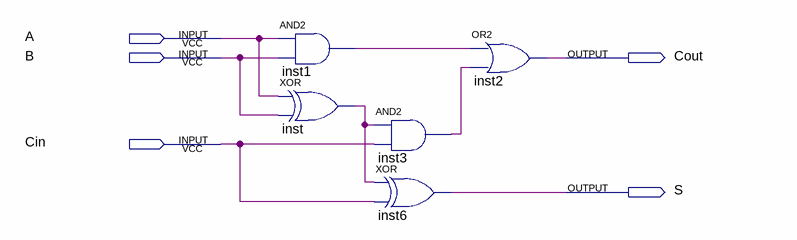
[diagram p0: schematic sheet]
// Quartus schematic sum_1b.bdf as structural Verilog: 5 symbols, 5 pins
module sum_1b (
  input  A,
  input  B,
  input  Cin,
  output Cout,
  output S
);

  wire inst1_out, inst3_out, inst_out;

  and inst1 (inst1_out, A, B);
  xor inst (inst_out, A, B);
  and inst3 (inst3_out, inst_out, Cin);
  xor inst6 (S, inst_out, Cin);
  or inst2 (Cout, inst1_out, inst3_out);
endmodule
